# Altium schematic sheet schematic.SchDoc
size A
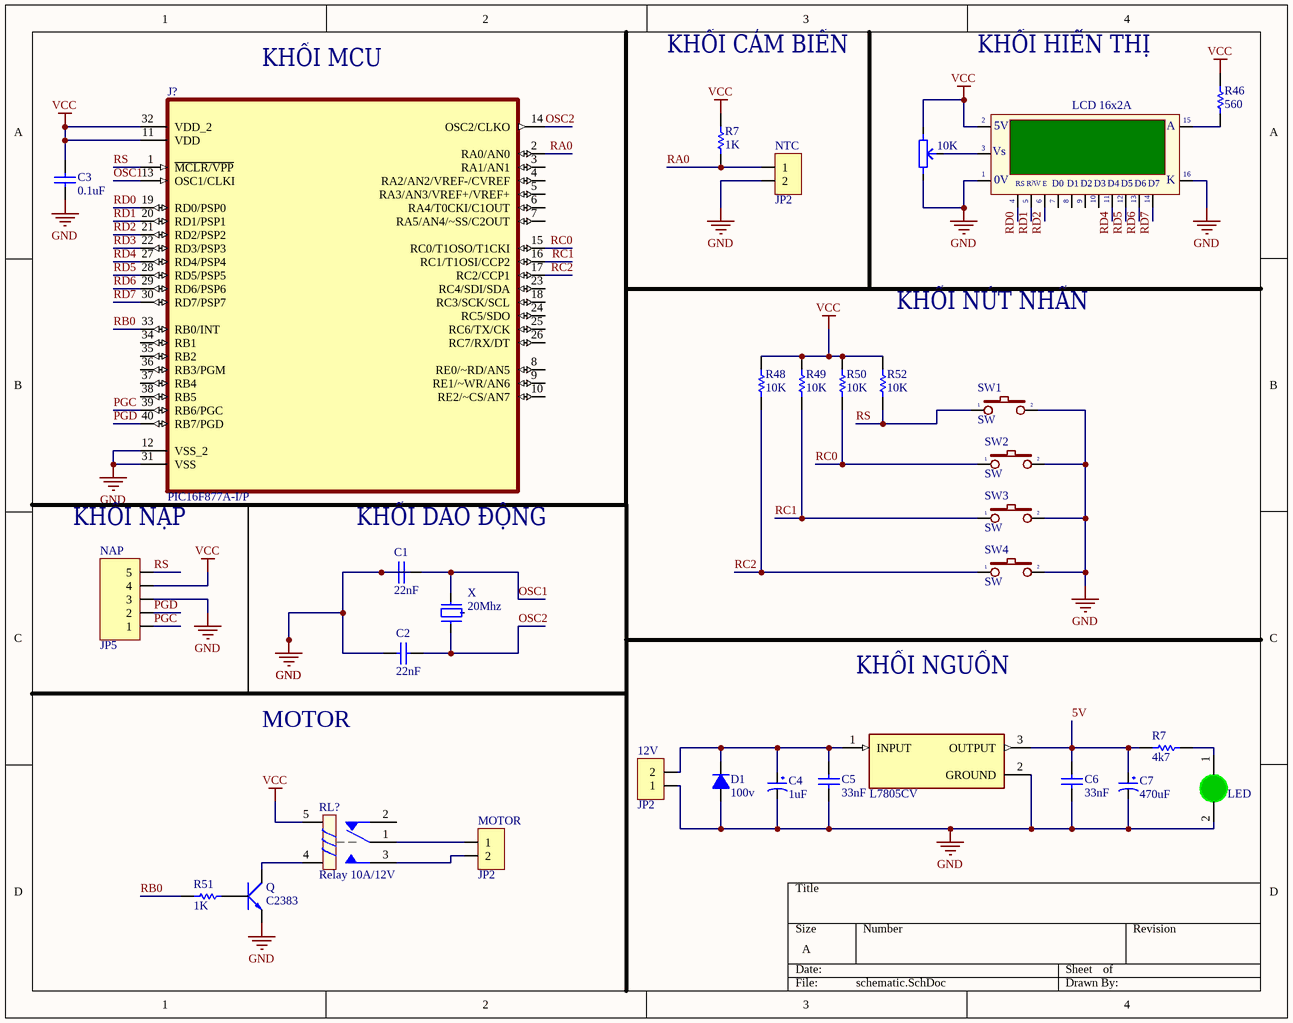
[diagram p0: schematic.SchDoc]

## Parts
(Parts that share a designator on the sheet are numbered #1, #2 ... from top to bottom, then left to right.)
12V  JP2  [JP2-C1T]
?#1  10K  [Bien Tro Tam Giac Dung]
?#2  LCD 16x2A  [JP16-C1T]
?#3  L7805CV  [TO255P1040X460X1968-3]
?#4  LED  [LED-3MM-GREEN]
C1  22nF  [tu 0805]
C2  22nF  [tu 0805]
C3  0.1uF  [tu 0805]
C4  1uF  [tu hoa 5mm]
C5  33nF  [tu 0805]
C6  33nF  [tu 0805]
C7  470uF  [tu hoa 5mm]
D1  100v  [DIODE 1A]
J?  PIC16F877A-I/P  [DIP254P1524X483-40]
MOTOR  JP2  [JP2-C1T]
NAP  JP5  [JP5-C1T]
NTC  JP2  [JP2-C1T]
Q  C2383  [QTO-92]
R7#1  value 1K  [R1/4W]  (hidden comment: Res1)
R7#2  value 4k7  [R1/4W]  (hidden comment: Res1)
R46  value 560  [R1/4W]  (hidden comment: Res1)
R48  value 10K  [R1/4W]  (hidden comment: Res1)
R49  value 10K  [R1/4W]  (hidden comment: Res1)
R50  value 10K  [R1/4W]  (hidden comment: Res1)
R51  value 1K  [R1/4W]  (hidden comment: Res1)
R52  value 10K  [R1/4W]  (hidden comment: Res1)
RL?  Relay 10A/12V  [RELAY 5]
SW1  SW  [SW1-SMD]
SW2  SW  [SW1-SMD]
SW3  SW  [SW1-SMD]
SW4  SW  [SW1-SMD]
X  20Mhz  [XT3]

## Nets
GND: 12V.1 ?#1.3 ?#2.1(GND) ?#2.16(K) ?#3.2(GROUND) ?#4.2(K) C1.1 C2.2 C3.2 C4.2 C5.2 C6.2 C7.2 D1.1(A) J?.12(VSS_2) J?.31(VSS) NAP.3 NTC.2 Q.1(E) SW1.2 SW2.2 SW3.2 SW4.2
VCC: ?#1.1 ?#2.2(VDD) C3.1 J?.11(VDD) J?.32(VDD_2) NAP.4 R7#1.1 R46.2 R48.1 R49.1 R50.1 R52.1 RL?.5
5V: ?#3.3(OUTPUT) C6.1 C7.1 R7#2.2
OSC1: C1.2 J?.13(OSC1/CLKI) X.2
OSC2: C2.1 J?.14(OSC2/CLKO) X.1
PGC: J?.39(RB6/PGC) NAP.1
PGD: J?.40(RB7/PGD) NAP.2
RA0: J?.2(RA0/AN0) NTC.1 R7#1.2
RB0: J?.33(RB0/INT) R51.2
RC0: J?.15(RC0/T1OSO/T1CKI) R50.2 SW2.1
RC1: J?.16(RC1/T1OSI/CCP2) R49.2 SW3.1
RC2: J?.17(RC2/CCP1) R48.2 SW4.1
RD0: J?.19(RD0/PSP0)
RD1: J?.20(RD1/PSP1)
RD2: J?.21(RD2/PSP2)
RD3: J?.22(RD3/PSP3)
RD4: J?.27(RD4/PSP4)
RD5: J?.28(RD5/PSP5)
RD6: J?.29(RD6/PSP6)
RD~{7}: J?.30(RD7/PSP7)
RS: J?.1(~{MCLR/VPP}) NAP.5 R52.2 SW1.1
Net12V_2: 12V.2 ?#3.1(INPUT) C4.1 C5.1 D1.2(K)
Net?#1_2: ?#1.2 ?#2.3(VEE)
Net?#2_15: ?#2.15(A) R46.1
Net?#4_1: ?#4.1(A) R7#2.1
NetMOTOR_1: MOTOR.1 RL?.1
NetMOTOR_2: MOTOR.2 RL?.3
NetQ_2: Q.2(C) RL?.4
NetQ_3: Q.3(B) R51.1

Not connected (* = marked no-connect by the designer): ?#2 4(RS) 5(R/~{W}) 6(~{EN}) 7(D0) 8(D1) 9(D2) 10(D3) 11(D4) 12(D5) 13(D6) 14(D7); J? 3(RA1/AN1) 4(RA2/AN2/VREF-/CVREF) 5(RA3/AN3/VREF+/VREF+) 6(RA4/T0CKI/C1OUT) 7(RA5/AN4/~SS/C2OUT) 8(RE0/~RD/AN5) 9(RE1/~WR/AN6) 10(RE2/~CS/AN7) 18(RC3/SCK/SCL) 23(RC4/SDI/SDA) 24(RC5/SDO) 25(RC6/TX/CK) 26(RC7/RX/DT) 34(RB1) 35(RB2) 36(RB3/PGM) 37(RB4) 38(RB5); RL? 2; X 3

## Notes on the sheet
- KHỐI MCU
- KHỐI CẢM BIẾN
- KHỐI HIỂN THỊ
- KHỐI NÚT NHẤN
- KHỐI NẠP
- KHỐI DAO ĐỘNG
- KHỐI NGUỒN
- MOTOR
- Labels drawn without touching a wire or pin: RD0, RD1, RD2, RD4, RD5, RD6, RD~{7}
- (in symbol LCD16x2A) 5V; Vs; |; 0V; R/W; E

## Library data of the parts
12V MOTOR NTC = JP2: WR-PHD 2.54 mm Angled Socket Header; Manufacturer: W¨¹rth Elektronik eiSos GmbH; partNo: 613002143121; ComponentLink1 Description: Manufacturer; ComponentLink2 Description: Datasheet; NoPins: 02; Created Date: 29 March 2013; ComponentLink1URL: http://www.we-online.com; ComponentLink2URL: http://katalog.we-online.de/em/datasheet/6130xx143121.pdf; Created by: Karrer Zheng
?#1 = Bien tro tam giac 10K Dung: Cắm; Ma_Hang: MH000919; Don_Vi: Con; Ten_Linh_Kien: Biến Trở Tam Giác 103-10K RM065 (Chân Đứng); Chung_Loai: Cắm; Kieu_Chan: *
?#2 = LCD16x2A: LCD dipslay 16 char, 2 line; Value: LCD16x2A
?#3 = L7805CV: Linear Voltage Regulator IC Positive Fixed 1 Output 1.5A TO-220; MF: STMicroelectronics; SnapEDA_Link: https://www.snapeda.com/parts/L7805CV/STMicroelectronics/view-part/?ref=snap; Package: TO-220-3 ON Semiconductor; MP: L7805CV; Check_prices: https://www.snapeda.com/parts/L7805CV/STMicroelectronics/view-part/?ref=eda; Purchase-URL: https://pricing.snapeda.com/search/part/L7805CV/?ref=eda; Price: None; Value: *; Availability: In Stock
?#4 = LED 3mm Xanh La: Cắm; Don_Vi: Con; Ma_Hang: MH001054; Ten_Linh_Kien: Led 3MM Phủ Xanh (10c); Ghi_Chu: *; Kieu_Chan: *; Chung_Loai: Cắm
C1-C3 C5 C6 = Tu 0805 33nF 50V 20%: Dán; Don_Vi: Con; So_Chan: 2; Ten_Linh_Kien: Tụ 0805 33nF 50V 20%; Ma_Hang: MH007854; Kieu_Chan: *; Chung_Loai: Dán
C4 C7 = Tu Hoa 1uF 50V 5x11: Cắm; Don_Vi: Con; So_Chan: 2; Ten_Linh_Kien: Tụ Hóa 1uF 50V 5x11MM; Ma_Hang: MH001355; Chung_Loai: Cắm; Kieu_Chan: *
D1 = Diode 1N4007: Cắm; Ten_Linh_Kien: Diode 1N4007 1A (DIP); Don_Vi: Con; Ma_Hang: MH001063; Ghi Chu: *; Kieu_Chan: *; Chung_Loai: Cắm
J? = PIC16F877A-I/P: PIC PICÂ® 16F Microcontroller IC 8-Bit 20MHz 14KB (8K x 14) FLASH 44-TQFP (10x10); MF: Microchip; MP: PIC16F877A-I/P; Package: DIP-40 Microchip; SnapEDA_Link: https://www.snapeda.com/parts/PIC16F877A-I/P/Microchip/view-part/?ref=snap; Check_prices: https://www.snapeda.com/parts/PIC16F877A-I/P/Microchip/view-part/?ref=eda; Availability: In Stock; Value: *; Price: None
NAP = JP5: WR-PHD 2.54 mm Angled Socket Header; Manufacturer: W¨¹rth Elektronik eiSos GmbH; partNo: 613005143121; ComponentLink1 Description: Manufacturer; ComponentLink2 Description: Datasheet; NoPins: 05; Created Date: 29 March 2013; ComponentLink1URL: http://www.we-online.com; ComponentLink2URL: http://katalog.we-online.de/em/datasheet/6130xx143121.pdf; Created by: Karrer Zheng
Q = NPN_ECB: P 600mW, ECB; Value: C1815
R7#1 R7#2 R46 R48-R52 = Res1_4: Resistor; Manufacturer: Generic Components; Class: Passive; Published: 08/06/2000; Publisher: Altium Hobart Technology Centre; SubClass: Resistor
RL? = Relay 5: Relay SPDT,10A - 12VDC 5 Pin; Value: Relay SPDT, 10A, 12V
SW1-SW4 = SW2: Switch button 2 pin; Value: SW chip 2 pin
X = XT3: Crystal For all Crystal 2pin.; Value: 4Mhz